# Altium project ENEL400_AFE_ADC.PrjPcb
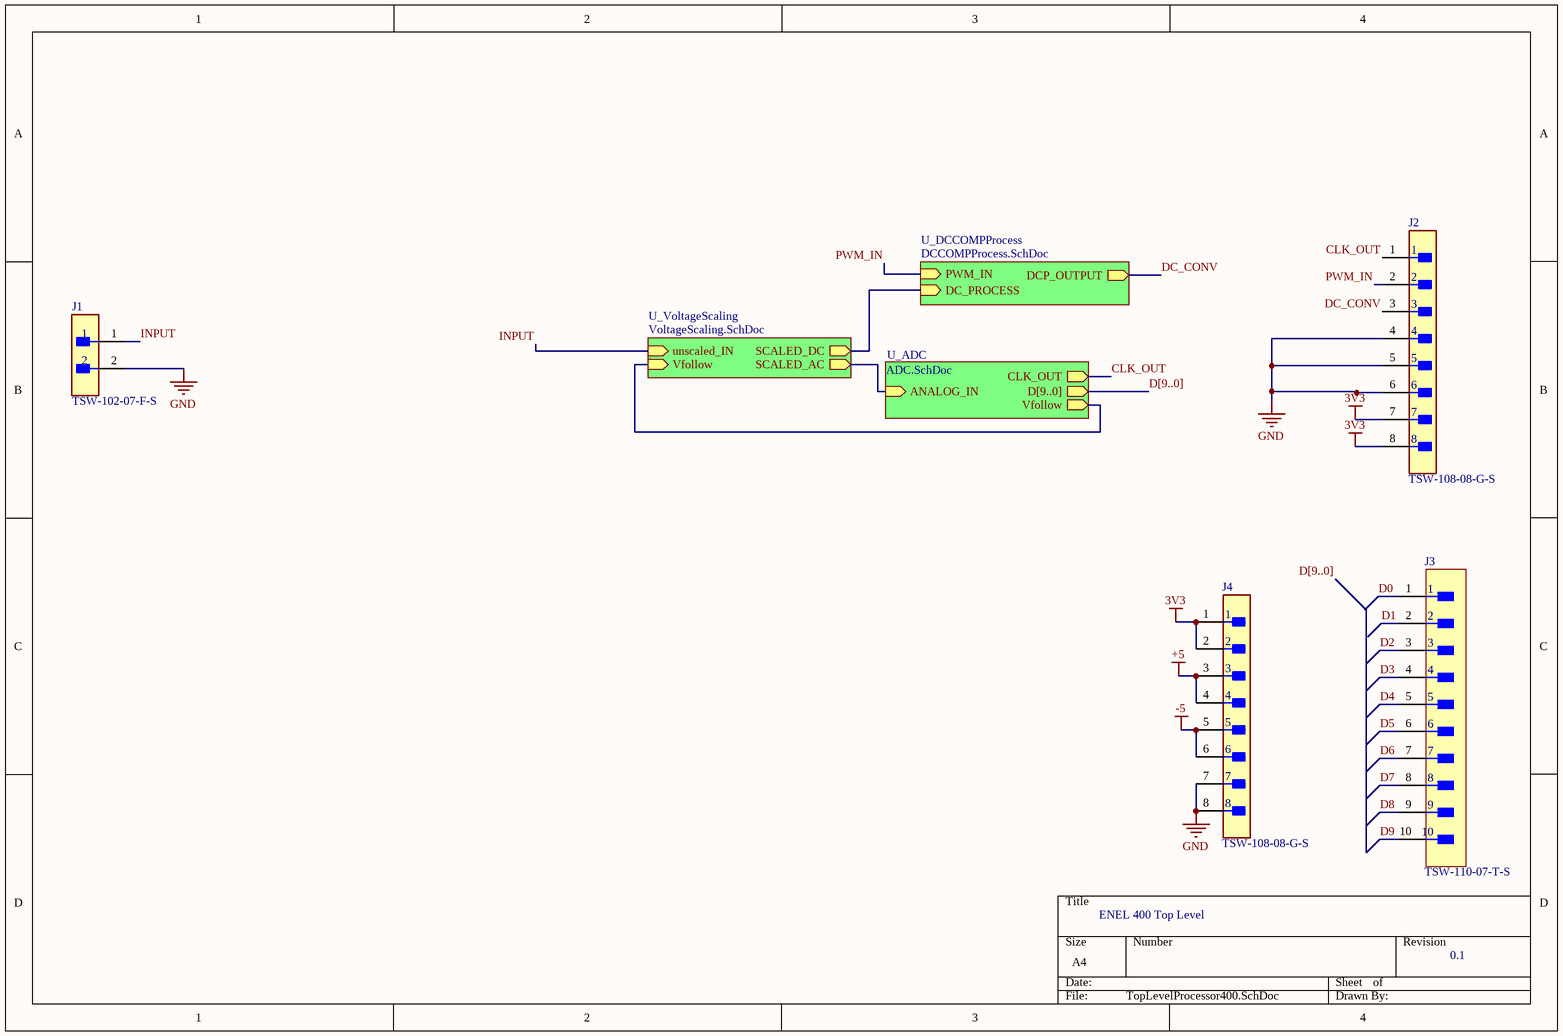
[diagram p0: TopLevelProcessor400.SchDoc]
4 sheets, 34 parts. Net scope: hierarchical (ports join the sheet entries above them; power ports are global).
Board file: afeBoaard.PcbDoc
Sheets:
  TopLevelProcessor400.SchDoc
    U_VoltageScaling = VoltageScaling.SchDoc
    U_ADC = ADC.SchDoc
    U_DCCOMPProcess = DCCOMPProcess.SchDoc

## Sheet TopLevelProcessor400.SchDoc: ENEL 400 Top Level
size A4; Author: Ibrahim Khalid; CompanyName: Big Daddy AweScilloscope; Revision: 0.1; SheetNumber: 1; SheetTotal: 4

### Parts
J1  TSW-102-07-F-S  [FP-TSW-102-07-F-S-MFG]
J2  TSW-108-08-G-S  [FP-TSW-108-08-G-S-MFG]
J3  TSW-110-07-T-S  [FP-TSW-110-07-T-S-MFG]
J4  TSW-108-08-G-S  [FP-TSW-108-08-G-S-MFG]

### Sub-sheets
U_ADC = ADC.SchDoc: D[9..0] (out), ANALOG_IN (in), Vfollow (out), CLK_OUT (out)
U_DCCOMPProcess = DCCOMPProcess.SchDoc: DC_PROCESS (in), DCP_OUTPUT (out), PWM_IN (in)
U_VoltageScaling = VoltageScaling.SchDoc: unscaled_IN (in), SCALED_AC (out), SCALED_DC (out), Vfollow (in)

### Nets
3V3: J2.7 J2.8 J4.1 J4.2  [project net VDDA]
+5: J4.3 J4.4
-5: J4.5 J4.6
GND: J1.2 J2.4 J2.5 J2.6 J4.7 J4.8
CLK_OUT: J2.1 ; sheet U_ADC/CLK_OUT
D0: J3.1
D1: J3.2
D2: J3.3
D3: J3.4
D4: J3.5
D5: J3.6
D6: J3.7
D7: J3.8
D8: J3.9
D9: J3.10
DC_CONV: J2.3 ; sheet U_DCCOMPProcess/DCP_OUTPUT  [project net COMP_OUT]
DC_IN: sheet U_VoltageScaling/SCALED_DC, sheet U_DCCOMPProcess/DC_PROCESS
INPUT: J1.1 ; sheet U_VoltageScaling/unscaled_IN
PWM_IN: J2.2 ; sheet U_DCCOMPProcess/PWM_IN
Vfollow: sheet U_VoltageScaling/Vfollow, sheet U_ADC/Vfollow
NetR4_2: sheet U_VoltageScaling/SCALED_AC, sheet U_ADC/ANALOG_IN

### Buses and harness runs
bus D[9..0]
bus D[9..0] = sheet U_ADC/D[9..0]

### Library data of the parts
J1 = CMP-02766-001458-1: CONN HEADER VERT 2POS 2.54MM; Gender: Male; Max Current Rating: 7.6A; Number of Contacts: 2; Max Voltage Rating (AC): 550V; Orientation: Straight; Depth: 2.54mm; Series: TSW; Package Quantity: 1; Min Operating Temperature: -55°C; Max Operating Temperature: 125°C; Contact Type: Male Pin; Contact Shape: Square; Color: Black; Housing Color: Black; Connector Type: Header; Fastening Type: Pull; Radiation Hardening: No; Pitch: 2.54mm; Housing Material: Polyester; Mount: Through Hole; Number of Positions: 2; Number of Rows: 1; Contact Material: Bronze; Insulation Color: Black; Contact Finish - Mating: GOLD; Termination: Solder; Insulation Material: PBT; Length: 5.08mm; Flammability Rating: UL94 V-0; Contact Mating Length: 0.23inch; REACH SVHC: No SVHC; Contact Plating: Gold; RoHS Compliant: Yes; Packaging: Bulk
J2 J4 = CMP-02766-000001-1: CONN HEADER VERT 8POS 2.54MM; Manufacturer: Samtec; Number Of Contacts: 8; Conn Orientation: Straight; Conn Gender: Male; Device Class L1: Connectors; ComponentLink2Description: Datasheet; Digikey Description: CONN HEADER VERT 8POS 2.54MM; ComponentLink2URL: http://suddendocs.samtec.com/catalog_english/tsw_th.pdf; Temperature: -55°C to +125°C; RoHS: TRUE; Mouser Description: TSW - Samtec 2.54mm Pin Header 13.46mm Overall Pin Length 5.08mm Tail; Automotive: No; Temperature Range High: +125°C; Package: TSW-108-08-G-S; Device Class L3: unset; Manufacturer Part Number: TSW-108-08-G-S; Pitch: 2.54mm; Number Of Rows: 1; Lead Free: Yes; Height: 8.71mm; Contact Material: Gold,Nickel; Footprint Url: http://suddendocs.samtec.com/prints/tsw-xxx-xx-x-x-xx-xxx-footprint.pdf; Temperature Range Low: -55°C; Octopart: https://octopart.com/tsw-108-08-g-s-samtec-272653; Category: Conn; Device Class L2: Headers and Wire Housings
J3 = CMP-00575-00272505-1: TSW-110-07-T-S TSW - Samtec 2.54mm Pin Header 10.92mm Overall Pin Length (07) (mcv)(TO22); Manufacturer Lifecycle Status: PRODUCTION; Connector Type: Male Pin; Number of Positions: 10; Max Current Rating: 7.6A; Gender: Male; Max Voltage Rating (AC): 550V; Max Operating Temperature: 105°C; Packaging: Bulk; Lead Free: Lead Free; Min Operating Temperature: -55°C; Width: 2.54mm; RoHS: Compliant; Depth: 2.54mm; Lifecycle Status: Production; REACH SVHC: No SVHC; Height: 8.71mm; Number of Rows: 1; Housing Material: Polyester; Orientation: Straight; Radiation Hardening: No; Number of Contacts: 10; Housing Color: Black; Mount: Through Hole; Lead Pitch: 2.54mm; Termination: Solder; Color: Black; Contact Material: Nickel, Tin; Number of Pins: 10; Length: 25.4mm; Pitch: 2.54mm; Contact Plating: Tin; Contact Mating Length: 5.842mm

## Sheet VoltageScaling.SchDoc
size A4; SheetNumber: 2; SheetTotal: 4
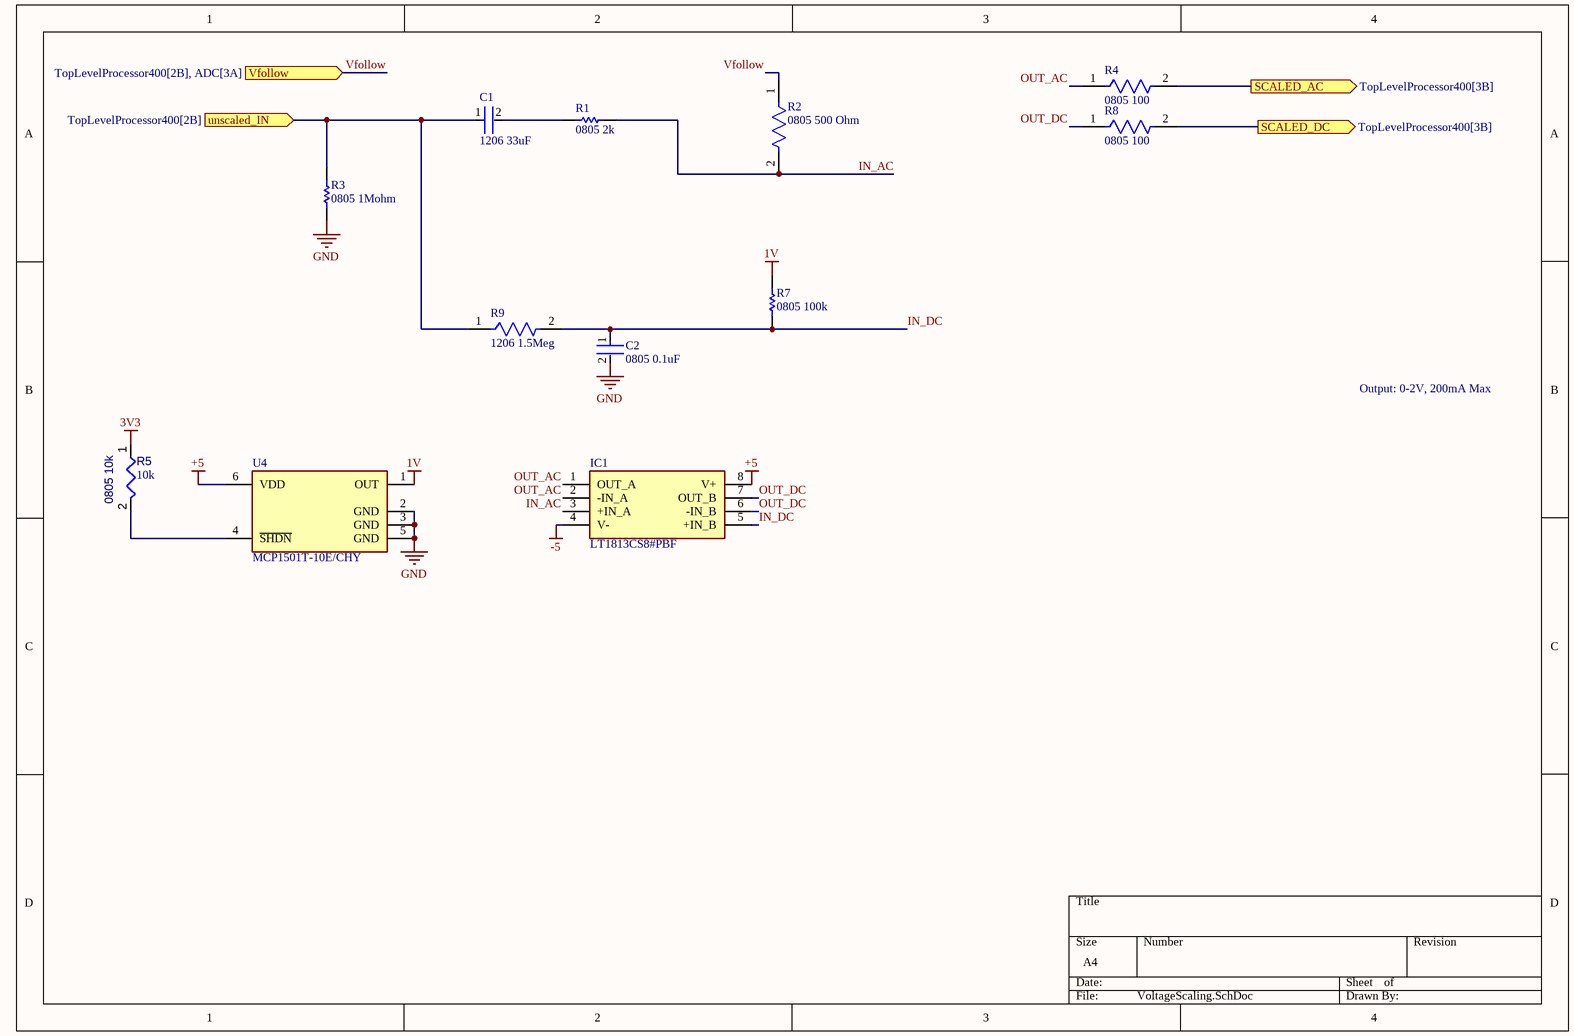
[diagram p1: VoltageScaling.SchDoc]

### Parts
C1  1206 33uF  [FP-C3216-160-0_2-IPC_A]
C2  0805 0.1uF  [FP-0805B-IPC_C]
IC1  LT1813CS8#PBF  [SOIC127P599X175-8N]
R1  0805 2k  [RESC2013X60X30ML20T20]
R2  0805 500 Ohm  [FP-RNCF0805-MFG]
R3  0805 1Mohm  [RESC2013X50X30LL20T20]
R4  0805 100  [FP-TNPW0805-e3-MFG]
R5  0805 10k  value 10k  [RESC2013X50X35ML15T15]
R7  0805 100k  [RESC2013X60X30LL20T20]
R8  0805 100  [FP-TNPW0805-e3-MFG]
R9  1206 1.5Meg  [FP-MCR18-MFG]
U4  MCP1501T-10E/CHY  [FP-C04-028-IPC_C]

### Ports
SCALED_AC (out, see TopLevelProcessor400[3B]), SCALED_DC (out, see TopLevelProcessor400[3B]), unscaled_IN (in, see TopLevelProcessor400[2B]), Vfollow (in, see TopLevelProcessor400[2B], ADC[3A])

### Nets
1V: R7.1 U4.1(OUT)
3V3: R5.1  [project net VDDA]
+5: IC1.8(V+) U4.6(VDD)
-5: IC1.4(V-)
GND: C2.2 R3.2 U4.2(GND) U4.3(GND) U4.5(GND)
DC_IN: R8.2 ; port SCALED_DC
IN_AC: IC1.3(+IN_A) R1.2 R2.2
IN_DC: C2.1 IC1.5(+IN_B) R7.2 R9.2
INPUT: C1.1 R3.1 R9.1 ; port unscaled_IN
OUT_AC: IC1.1(OUT_A) IC1.2(-IN_A) R4.1
OUT_DC: IC1.6(-IN_B) IC1.7(OUT_B) R8.1
Vfollow: R2.1 ; port Vfollow
NetC1_2: C1.2 R1.1
NetR4_2: R4.2 ; port SCALED_AC
NetR5_2: R5.2 U4.4(~{SHDN})

### Notes on the sheet
- Output: 0-2V, 200mA Max

### Library data of the parts
C1 = CMP-08246-002728-1: Multilayer Ceramic Capacitors 33uF ±20% 25V X5R SMD 1206  C3216X5R1E336M160AC; Dielectric Material: Ceramic; Case Code (Imperial): 1206; Case Code (Metric): 3216; Max Operating Temperature: 85°C; Width: 0.063inch; Series: C; Case/Package: 1206; Lead Free: Lead Free; Voltage Rating: 25V; Voltage Rating (DC): 25V; Thickness: 1.6mm; Packaging: Tape and Reel; Mount: Surface Mount; Capacitance: 33uF; REACH SVHC: No SVHC; Length: 3.2mm; Min Operating Temperature: -55°C; Package Quantity: 1; RoHS Compliant: Yes; Resistor Type: Ceramic; Dielectric: X5R; Depth: 1.6mm; Termination: SMD/SMT; Tolerance: 20%; Weight: 0.000571oz
C2 = CMP-45632-000003-1: CAP CER 0.1UF 50V X7R 0805     0805B104K500CT; Capacitance: 100nF; Tolerance: 10%; RoHS Compliant: Yes; Packaging: Tape and Reel; Voltage Rating (DC): 50V; Voltage Rating: 50V; Length: 2mm; Lead Free: Lead Free; Voltage: 50V; Case/Package: 0805; Case Code (Metric): 2012; Depth: 1.25mm; Min Operating Temperature: -55°C; Case Code (Imperial): 0805; Max Operating Temperature: 125°C; Radiation Hardening: No; Dielectric: X7R
IC1 = LT1813CS8#PBF: Integrated Circuit; Manufacturer_Name: Analog Devices; Datasheet Link: https://www.analog.com/media/en/technical-documentation/data-sheets/18134fa.pdf; Height: 1.752mm; Manufacturer_Part_Number: LT1813CS8#PBF; Mouser Part Number: 584-LT1813CS8#PBF; Mouser Price/Stock: https://www.mouser.co.uk/ProductDetail/Analog-Devices/LT1813CS8PBF?qs=ytflclh7QUVE2rX4b3OP3g%3D%3D; Arrow Part Number: LT1813CS8#PBF; Arrow Price/Stock: https://www.arrow.com/en/products/lt1813cs8pbf/analog-devices
R1 = CMP-2001-01798-1: RK73B2ATTD202J; Manufacturer: KOA Speer; Part Number: RK73B2ATTD202J
R2 = CMP-00347-25743669-1: RNCF0805TKY500R RNCF Precision Thin Film Chip Resistor 0805 Size 500 Ohm 0.01% 0.125 W 5 ppm/°C 2-Pin SMD T/R; Voltage Rating: 150V; Power Rating: 125mW; Resistance: 500Ω; Max Operating Temperature: 155°C; Composition: Thin Film; Min Operating Temperature: -55°C; Temperature Coefficient: 5ppm/°C; Case/Package: 0805; NexarPartId: 25743669; Mount: Surface Mount; Height: 650µm; Tolerance: 0.01%; RoHS: Non-Compliant
R3 = CMP-2001-03632-1: CRCW08051M00JNEA; Manufacturer: Vishay Dale; Part Number: CRCW08051M00JNEA
R4 R8 = CMP-02407-011566-1: RES 100 OHM 0.1% 1/8W 0805    TNPW0805100RBYEN; RoHS Compliant: Yes
R5 = CMP-009-00018-5: Chip Resistor, 10 KOhm, +/- 1%, 125 mW, -55 to 155 degC, 0805 (2012 Metric); Power: 125mW; Voltage Rating: 150V; Tolerance: 1%; Pins: 2; Min Operating Temperature: -55°C; Case/Package: 0805; Max Operating Temperature: 155°C; RoHS Compliant: True; Mounting Technology: SM
R7 = CMP-2001-02684-1: 100k 0805    SG73S2ATTD1003F; Manufacturer: KOA Speer; Part Number: SG73S2ATTD1003F
R9 = CMP-08839-018795-1: Thick Film Chip Resistor, 1206, 1.5MΩ, 5%, 200ppm/°C, 0.25W, 200V   MCR18FZHJ155; Resistance: 1.5MR; Tolerance: 5%; RoHS Compliant: Yes
U4 = CMP-06323-000005-1: IC VREF SERIES 0.1% SOT23-6; Operating Supply Current: 550uA; Output Current: 20mA; Temperature Coefficient: 50ppm/°C; Min Output Voltage: 1.024V; Output Type: Fixed; Min Operating Temperature: -40°C; Reference Type: Series; Tolerance: 0.1%; Case/Package: SOT-23-6; RoHS Compliant: Yes; Max Operating Temperature: 125°C; Packaging: Tape and Reel; Mount: Surface Mount

## Sheet ADC.SchDoc: Oscilly AFE Schematic
size A4; ApprovedBy: Ibrahim Khalid; Author: Ibrahim Khalid; CompanyName: Oscilly; DrawnBy: Ibrahim Khalid; DocumentNumber: Page 3 of 4; Revision: 1.0; SheetNumber: 3; SheetTotal: 4
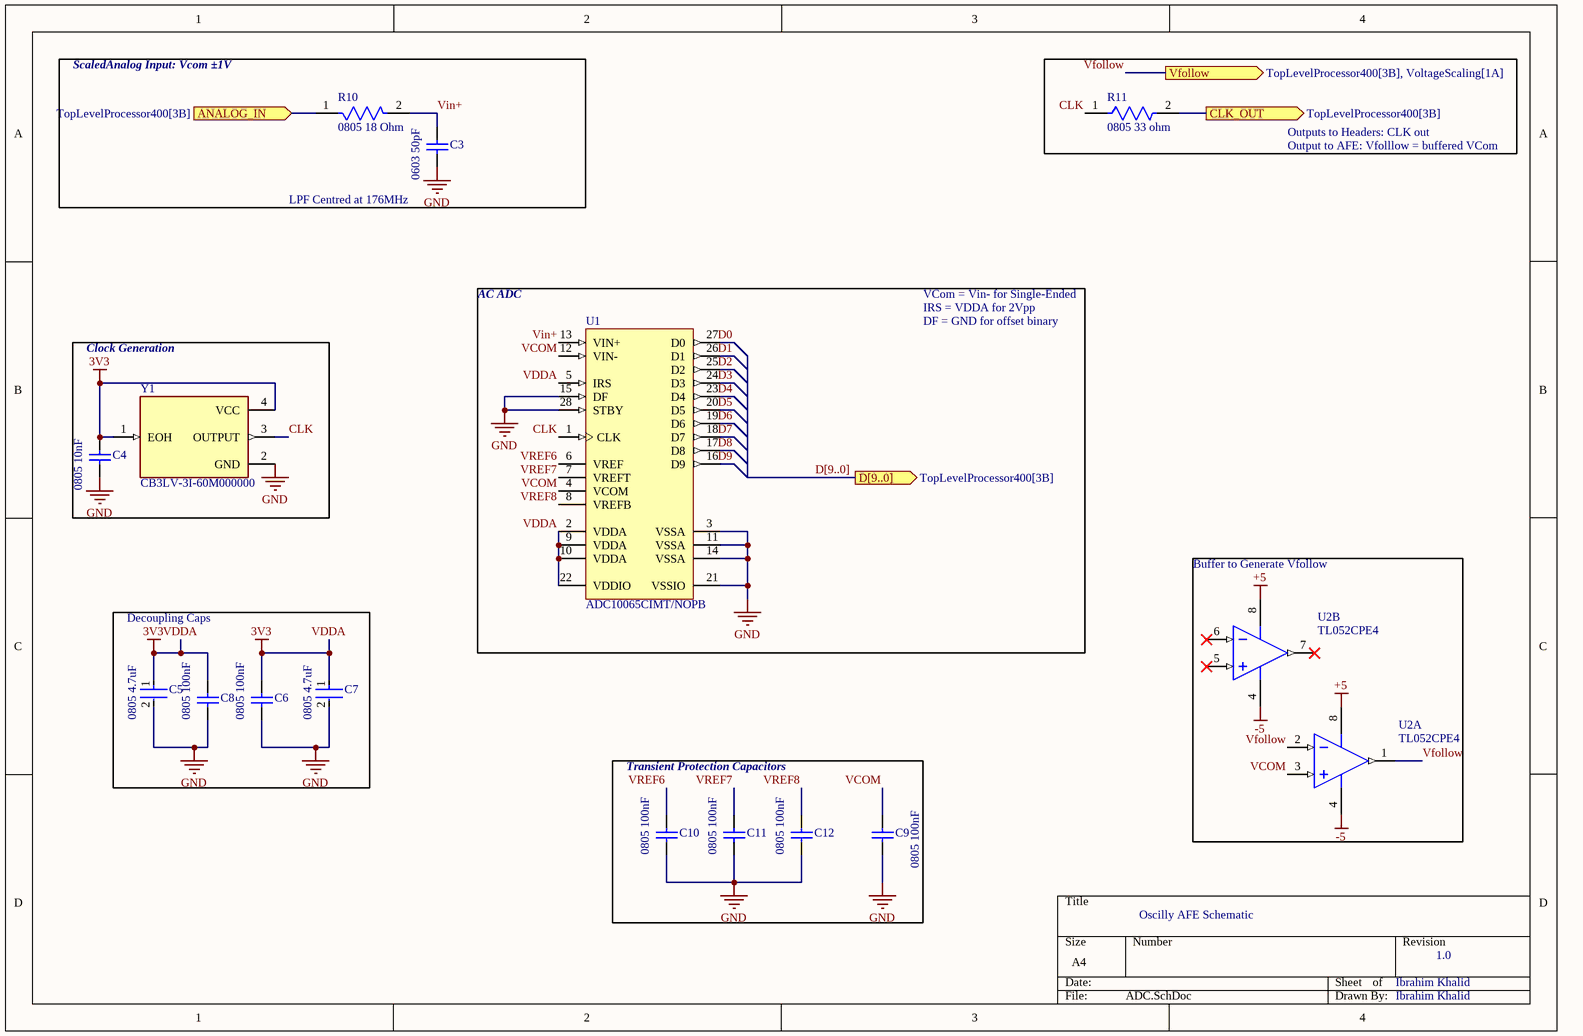
[diagram p2: ADC.SchDoc]

### Parts
C3  0603 50pF  [CAPC1608X90X35ML15T15]
C4  0805 10nF  [CAPC0805(2012)100_M]
C5  0805 4.7uF  [FP-CC0805-0_85-MFG]
C6  0805 100nF  [CAPC2013X140X50ML20T25]
C7  0805 4.7uF  [FP-CC0805-0_85-MFG]
C8  0805 100nF  [CAPC2013X140X50ML20T25]
C9  0805 100nF  [CAPC2013X140X50ML20T25]
C10  0805 100nF  [CAPC2013X140X50ML20T25]
C11  0805 100nF  [CAPC2013X140X50ML20T25]
C12  0805 100nF  [CAPC2013X140X50ML20T25]
R10  0805 18 Ohm  [FP-CR0805-IPC_B]
R11  0805 33 ohm  [FP-AC0805-MFG]
U1  ADC10065CIMT/NOPB  [PW0028A_L]
U2  TL052CPE4  [TI-P8]  (parts A,B of 2)
Y1  CB3LV-3I-60M000000  [OSC_CB3LV-3I-60M000000]

### Blocks framed on the sheet
Clock Generation: C4 Y1
Buffer to Generate Vfollow: U2
Decoupling Caps: C5-C8
Transient Protection Capacitors: C9-C12

### Ports
ANALOG_IN (in, see TopLevelProcessor400[3B]), CLK_OUT (out, see TopLevelProcessor400[3B]), D[9..0] (out, see TopLevelProcessor400[3B]), Vfollow (out, see TopLevelProcessor400[3B], VoltageScaling[1A])

### Nets
+5: U2.8(VCC+)
-5: U2.4(VCC-)
GND: C3.2 C4.2 C5.2 C6.2 C7.2 C8.2 C9.2 C10.2 C11.2 C12.2 U1.3(VSSA) U1.11(VSSA) U1.14(VSSA) U1.15(DF) U1.21(VSSIO) U1.28(STBY) Y1.2(GND)
VDDA: C4.1 C5.1 C6.1 C7.1 C8.1 U1.2(VDDA) U1.5(IRS) U1.9(VDDA) U1.10(VDDA) U1.22(VDDIO) Y1.1(EOH) Y1.4(VCC)  [also labelled 3V3]
CLK: R11.1 U1.1(CLK) Y1.3(OUTPUT)
CLK_OUT: R11.2 ; port CLK_OUT
D0: U1.27(D0)
D1: U1.26(D1)
D2: U1.25(D2)
D3: U1.24(D3)
D4: U1.23(D4)
D5: U1.20(D5)
D6: U1.19(D6)
D7: U1.18(D7)
D8: U1.17(D8)
D9: U1.16(D9)
VCOM: C9.1 U1.4(VCOM) U1.12(VIN-) U2.3(IN1+)
Vfollow: U2.1(OUT1) U2.2(IN1-) ; port Vfollow
Vin+: C3.1 R10.2 U1.13(VIN+)
VREF6: C10.1 U1.6(VREF)
VREF7: C11.1 U1.7(VREFT)
VREF8: C12.1 U1.8(VREFB)
NetR4_2: R10.1 ; port ANALOG_IN

Not connected (* = marked no-connect by the designer): U2 5(IN2+)* 6(IN2-)* 7(OUT2)*

### Buses and harness runs
bus D[9..0] = port D[9..0]

### Notes on the sheet
- ScaledAnalog Input: Vcom ±1V
- Outputs to Headers: CLK out
- Output to AFE: Vfolllow = buffered VCom
- (near C3) LPF Centred at 176MHz
- AC ADC
- VCom = Vin- for Single-Ended
- IRS = VDDA for 2Vpp
- DF = GND for offset binary

### Library data of the parts
C3 = CMP-2006-04331-1: 06035A500JAT2A; Manufacturer: AVX Interconnect / Elco; Part Number: 06035A500JAT2A
C4 = CMP-1036-03863-1: CAP 10nF 200V ±20% 0805 (2012 Metric) Thickness 1mm SMD; Case-EIA: 0805; Tolerance: Â±20%; Case-Metric: 2012; Technology: SMT; Value: 10nF; Rated Voltage: 200 V; Max Thickness: 1 mm
C5 C7 = CMP-03422-000207-1: CAP CER 4.7UF 16V X7R 0805   CC0805KKX7R7BB475; Manufacturer: Yageo; Tolerance: 0.1; Material: Ceramic; Footprint Url: http://www.yageo.com/exep/pages/download/literatures/UPY-C_GEN_24.pdf; Device Class L3: Ceramic Capacitors; Temperature: -30°C to +85°C; Device Class L2: Capacitors; Automotive: No; Digikey Description: CAP CER 4.7UF 16V X7R 0805; Temperature Range High: +85°C; Lead Free: Yes; Mouser Description: Multilayer Ceramic Capacitors MLCC - SMD/SMT 4.7M pF 10% 16 Volts; Temperature Characteristic: X7R; Height: 0.95mm; Device Class L1: Passive Components; ComponentLink2Description: Datasheet; Category: Cap; Octopart: https://octopart.com/cc0805kkx7r7bb475-yageo-34429188; Temperature Range Low: -30°C; Manufacturer Part Number: CC0805KKX7R7BB475; Package: CC0805-0.85; Ipc Land Pattern Name: CAPC200125X85; RoHS: TRUE; Value: 4.7 uF; Capacitance: 4.7 uF; ComponentLink2URL: http://www.yageo.com/documents/recent/UPY-GPHC_Y5V_6.3V-to-50V_8.pdf; Voltage Rating: 16 V
C6 C8-C12 = CMP-2007-04651-1: 0805DD104KAT2A; Manufacturer: AVX Interconnect / Elco; Part Number: 0805DD104KAT2A
R10 = CMP-07231-001839-1: Thick Film Chip Resistors 0805 18Ω 0.125W 5% 200ppm/°C  CR0805-JW-180ELF; Power Rating: 125mW; Voltage Rating: 150V; Resistance: 18R; Max Operating Temperature: 155°C; Radiation Hardening: No; Packaging: Tape and Reel; Height: 0.024inch; Tolerance: 5%; Min Operating Temperature: -55°C; Thickness: 508um; Case/Package: 0805; Termination: SMD/SMT; Package Quantity: 5000; Contact Plating: Tin; Number of Terminations: 2; Military Standard: Not; Case Code (Metric): 2012; Composition: Thick Film; Width: 0.049inch; Max Power Dissipation: 125mW; Features: Moisture Resistant; Length: 2mm; Temperature Coefficient: 200ppm/°C; Case Code (Imperial): 0805; Depth: 1.25mm; Mount: Surface Mount
R11 = CMP-03412-037241-1: RES SMD 33 OHM 1% 1/8W 0805; Manufacturer: Yageo; Manufacturer Part Number: AC0805FR-0733RL; Automotive Grade: Grade 0; Value: 33Ω; Voltage Rating: 150V; Tolerance: 0.01; Octopart: https://octopart.com/ac0805fr-0733rl-yageo-46503501; Device Class L2: Resistors; Temperature: -55°C to +155°C; Composition: Thick Film; ComponentLink2URL: http://www.yageo.com/documents/recent/PYu-AC_51_RoHS_L_6.pdf; Automotive: Yes; Lead Free: Yes; Category: Res; Package: AC0805; Temperature Range Low: -55°C; Device Class L3: Chip SMD Resistors; Temperature Range High: +155°C; Mouser Description: Thick Film Resistors - SMD 1/8W 33ohm 1% AEC-Q200; Footprint Url: http://www.yageo.com/exep/pages/download/literatures/PYu-R_Mount_10.pdf; Resistance: 33Ω; Power Rating: 1/8W; RoHS: TRUE; ComponentLink2Description: Datasheet; Device Class L1: Passive Components; Height: 0.6mm; Series: AC; Digikey Description: RES SMD 33 OHM 1% 1/8W 0805; Ipc Land Pattern Name: RESC200125X50
U1 = CMP-0054-00382-3: 10-Bit 65 MSPS 3V A/D Converter, 28-pin TSSOP, Pb-Free; Manufacturer: Texas Instruments; CompType: ADC IC; PowerWise: Y; PackageTopMarking: NSUZXYTTE#*ADC10065*CIMT; Code_JEDEC: MO-153-AE; PackageReference: PW0028A; RoHS: Y; PackageDescription: Molded TSSOP, Jedec, 9.7 x 4.4 x 0.9mm Body, 28 Lead, 0.65mm Pitch; ComponentLink1Description: Datasheet URL; ComponentLink1URL: http://www.ti.com/general/docs/lit/getliterature.tsp?genericPartNumber=ADC10065&fileType=pdf; PinCount: 28
U2 = CMP-0017-01039-1: Dual Enhanced JFET Precision Operational Amplifier, 10 to 30 V, 0 to 70 degC, 8-pin DIP (P8), Pb-Free (RoHS); Manufacturer: Texas Instruments; Total Supply Voltage(Max)(+5V is 5, +/-5V is 10): 30; Vio (25C)(Max)(mV): 1.5; Iq per channel(Max)(mA): 2.8; Slew Rate(Typ)(V/us): 20.7; Offset Drift(Typ)(uV/C): 8; GBW(Typ)(MHz): 3; Total Supply Voltage(Min)(+5V is 5, +/-5V is 10): 10; CMRR(Min)(dB): 75; Sub Family: General Purpose Amplifier, High Supply Voltage Amplifier (>=30V); Vn at 1kHz(Typ)(nV/rtHz): 19; Rating: Military; IIB(Max)(pA): 200; Number of Channels: 2; PackageDescription: 8-Pin Plastic In-Line, Body 9.59 x 6.35 mm, Pitch 2.54 mm; ComponentLink1Description: Manufacturer URL; PackageReference: P8; ComponentLink2Description: Datasheet; Code_JEDEC: MS-001; ComponentLink3URL: http://www.ti.com/litv/pdf/mpdi001b; ComponentLink3Description: Package Specification; Mounting Technology: Through Hole; ComponentLink2URL: http://www.ti.com/lit/ds/symlink/tl052.pdf; Eco-Plan: Pb-Free (RoHS); PartNumber: TL052CPE4; ComponentLink1URL: http://www.ti.com/; PackageVersion: 4040082/E, 04/2010; DatasheetVersion: SLOS178A
Y1 = CMP-011-000000-1: 60 MHz XO (Standard) HCMOS, TTL Oscillator 3.3V Enable/Disable 4-SMD, No Lead; MF: CTS-Frequency Controls; Pin Count: 4; Component Type: Standard; Check_prices: https://www.snapeda.com/parts/CB3LV-3I-60M000000/CTS-Frequency+Controls/view-part/?ref=eda; Design Item ID: CB3LV-3I-60M000000; Source: CB3LV-3I-60M000000.SchLib; Package: NON STANDARD-4 CTS; Value: *; MP: CB3LV-3I-60M000000; SnapEDA_Link: https://www.snapeda.com/parts/CB3LV-3I-60M000000/CTS-Frequency+Controls/view-part/?ref=snap

## Sheet DCCOMPProcess.SchDoc: DC Processing Section
size A4; CheckedBy: Ibrahim Khalid; Author: Ibrahim Khalid; CompanyName: Oscilly; DocumentNumber: Page 4 of 4; Revision: 1.0; SheetNumber: 4; SheetTotal: 4
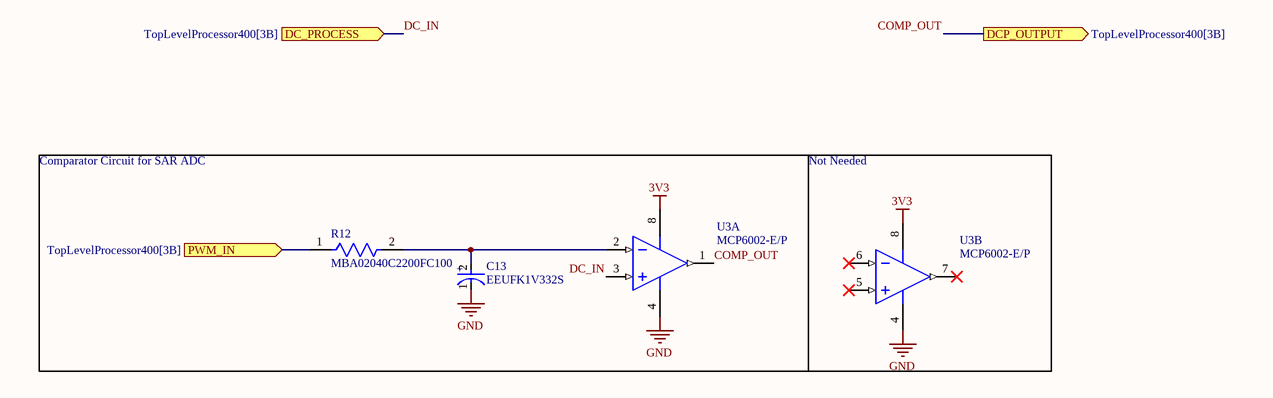
[diagram p3: DCCOMPProcess.SchDoc]

### Parts
C13  EEUFK1V332S  [FP-RAD-TH-D_18_0_5-L_25_2-MFG]
R12  MBA02040C2200FC100  [FP-MBA0204-MFG]
U3  MCP6002-E/P  [PDIP300-P8]  (parts A,B of 2)

### Blocks framed on the sheet
Comparator Circuit for SAR ADC: C13 R12 U3

### Ports
DC_PROCESS (in, see TopLevelProcessor400[3B]), DCP_OUTPUT (out, see TopLevelProcessor400[3B]), PWM_IN (in, see TopLevelProcessor400[3B])

### Nets
3V3: U3.8(VDD)  [project net VDDA]
GND: C13.1(C) U3.4(VSS)
COMP_OUT: U3.1(VOUTA) ; port DCP_OUTPUT
DC_IN: U3.3(VINA+) ; port DC_PROCESS
PWM_IN: R12.1 ; port PWM_IN
NetC13_2: C13.2(A) R12.2 U3.2(VINA-)

Not connected (* = marked no-connect by the designer): U3 5(VINB+)* 6(VINB-)* 7(VOUTB)*

### Notes on the sheet
- Not Needed
- (in symbol CMP-05427-000163-1) +

### Library data of the parts
C13 = CMP-05427-000163-1: Aluminum Electrolytic Capacitors (Radial Lead Type) AEC-Q200 Qualified 3300uF ±20% 35V; Lead Diameter: 0.8mm; Capacitance: 3.3mF; Ripple Current: 2.85A; Life (Hours): 5000Hour; Dielectric Material: Aluminium; Termination: Radial; Length: 25mm; Max Operating Temperature: 105°C; Number of Pins: 2; Voltage Rating: 35V; RoHS Compliant: Yes; REACH SVHC: No SVHC; Series: FK; Min Operating Temperature: -55°C; Voltage: 35V; Voltage Rating (DC): 35V; Packaging: Bulk; Height: 25mm; Lead Pitch: 7.5mm; Case/Package: Radial; Diameter: 18mm; Package Quantity: 50; Radiation Hardening: No; Construction: RADIAL; Tolerance: 20%; Mount: Through Hole
R12 = CMP-02408-000005-1: RES 220 OHM 0.4W 1% AXIAL; Manufacturer: Vishay BC Components; Automotive Grade: Grade 1; Value: 220Ω; Voltage Rating: 200V; Temperature Coefficient: 50ppm/°C; Power Rating: 0.25W; Digikey Description: RES 220 OHM 0.4W 1% AXIAL; Height: 1.6mm; Automotive: Yes; Lead Free: Yes; Mouser Description: Thin Film Resistors - Through Hole .4watt 220ohms 1% 1/8watt body size; Temperature Range Low: -55°C; ComponentLink2Description: Datasheet; Temperature: -55°C to +125°C; Device Class L3: Through-Hole Resistors; Manufacturer Part Number: MBA02040C2200FC100; Ipc Land Pattern Name: RESAD500W65L360D160; Octopart: https://octopart.com/mba02040c2200fc100-vishay-43743094; Series: MBA/SMA 0204; RoHS: TRUE; Tolerance: 1%; Package: MBA0204; Device Class L1: Passive Components; ComponentLink2URL: http://www.vishay.com/docs/28766/mbxsma.pdf; Category: Res; Composition: Metal Film; Device Class L2: Resistors; Temperature Range High: +125°C; Resistance: 220Ω
U3 = CMP-0187-00133-3: None; Slew Rate: 0.6V/µs; Supply Current: 100uA; Power Supply Rejection Ratio (PSRR): 86dB; Input Offset Voltage (Vos): 4.5mV; Input Bias Current: 1pA; Amplifier Type: GENERAL PURPOSE; Unity Gain Bandwidth Product: 1MHz; Number of Circuits: 2; Output Current: 23mA; Operating Supply Voltage: 5.5V; Min Supply Voltage: 1.8V; Common Mode Rejection Ratio: 60dB; Voltage Gain: 112dB; Max Supply Voltage: 6V; Package Quantity: 60; REACH SVHC: No SVHC; Min Operating Temperature: -40°C; Max Operating Temperature: 125°C; Mount: Through Hole; Nominal Supply Current: 100uA; Height: 3.3mm; Length: 9.27mm; Slew Rate-Nom: 0.6V/µs; Packaging: Rail/Tube; Output Current per Channel: 23mA; Number of Amplifiers: 2; RoHS Compliant: Yes; Radiation Hardening: No; Bandwidth: 1MHz; Lead Free: Lead Free; Width: 6.35mm; Number of Channels: 2; Gain Bandwidth Product: 1MHz; Technology: CMOS; Operating Supply Current: 100uA; Number of Elements: 2; Number of Pins: 8; Input Offset Voltage-Max: 4.5mV; Case/Package: PDIP

## Nets that join several sheets
+5: TopLevelProcessor400 (J4.3 J4.4), VoltageScaling (IC1.8 U4.6), ADC (U2.8)
-5: TopLevelProcessor400 (J4.5 J4.6), VoltageScaling (IC1.4), ADC (U2.4)
GND: TopLevelProcessor400 (6 pins), VoltageScaling (5 pins), ADC (17 pins), DCCOMPProcess (C13.1 U3.4)
VDDA: TopLevelProcessor400 (J2.7 J2.8 J4.1 J4.2), VoltageScaling (R5.1), ADC (12 pins), DCCOMPProcess (U3.8)
CLK_OUT: TopLevelProcessor400 (J2.1), ADC (R11.2)
COMP_OUT: TopLevelProcessor400 (J2.3), DCCOMPProcess (U3.1)
D0: TopLevelProcessor400 (J3.1), ADC (U1.27)
D1: TopLevelProcessor400 (J3.2), ADC (U1.26)
D2: TopLevelProcessor400 (J3.3), ADC (U1.25)
D3: TopLevelProcessor400 (J3.4), ADC (U1.24)
D4: TopLevelProcessor400 (J3.5), ADC (U1.23)
D5: TopLevelProcessor400 (J3.6), ADC (U1.20)
D6: TopLevelProcessor400 (J3.7), ADC (U1.19)
D7: TopLevelProcessor400 (J3.8), ADC (U1.18)
D8: TopLevelProcessor400 (J3.9), ADC (U1.17)
D9: TopLevelProcessor400 (J3.10), ADC (U1.16)
DC_IN: VoltageScaling (R8.2), DCCOMPProcess (U3.3)
INPUT: TopLevelProcessor400 (J1.1), VoltageScaling (C1.1 R3.1 R9.1)
NetR4_2: VoltageScaling (R4.2), ADC (R10.1)
PWM_IN: TopLevelProcessor400 (J2.2), DCCOMPProcess (R12.1)
Vfollow: VoltageScaling (R2.1), ADC (U2.1 U2.2)